# Altium schematic sheet Dogfish3D - Driver Channel.SchDoc
size A
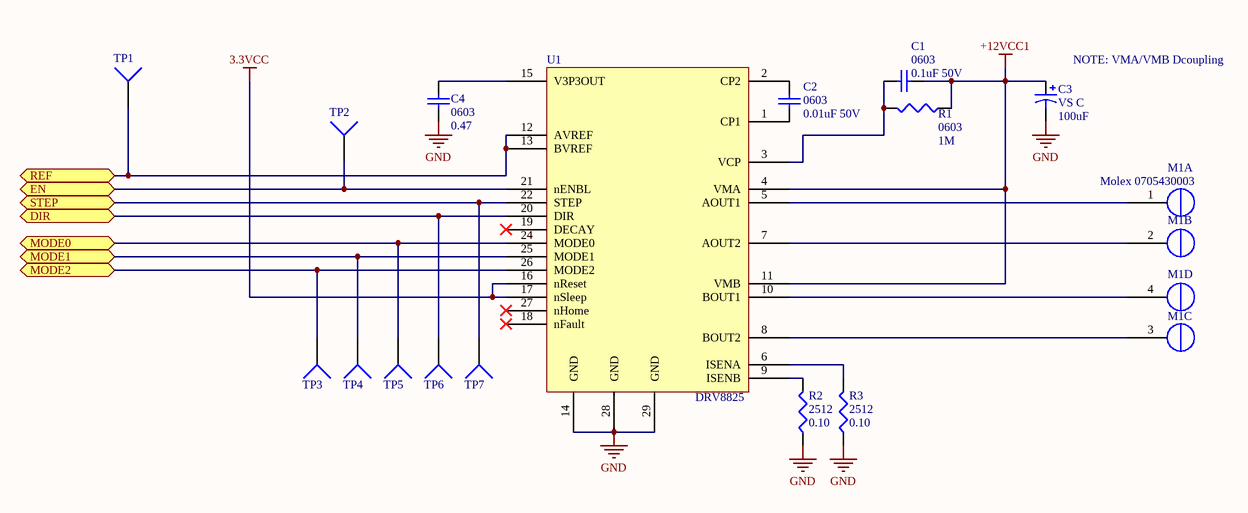
[diagram p0: Dogfish3D - Driver Channel.SchDoc]

## Parts
C1  0603  value 0.1uF 50V  [1608[0603]]
C2  0603  value 0.01uF 50V  [1608[0603]]
C3  VS C  value 100uF  [Panasonic VS C]
C4  0603  value 0.47  [1608[0603]]
M1  Molex 0705430003  [4POL254]  (parts A,B,C,D of 4)
R1  0603  value 1M  [J1-0603]
R2  2512  value 0.10  [Resistor2512]
R3  2512  value 0.10  [Resistor2512]
TP1  TP4  [TP-2]  (value not drawn)
TP2  TP4  [TP-2]  (value not drawn)
TP3  TP4  [TP-2]  (value not drawn)
TP4  TP4  [TP-2]  (value not drawn)
TP5  TP4  [TP-2]  (value not drawn)
TP6  TP4  [TP-2]  (value not drawn)
TP7  TP4  [TP-2]  (value not drawn)
U1  DRV8825  [DRV8825]

## Ports
DIR, EN, MODE0, MODE1, MODE2, REF, STEP

## Nets
3.3VCC: U1.16(nReset) U1.17(nSleep)
+12VCC1: C1.1 C3.1 R1.1 U1.4(VMA) U1.11(VMB)
GND: C3.2 C4.1 R2.1 R3.1 U1.14(GND) U1.28(GND) U1.29(GND)
DIR: TP6.1 U1.20(DIR) ; port DIR
EN: TP2.1 U1.21(nENBL) ; port EN
MODE0: TP5.1 U1.24(MODE0) ; port MODE0
MODE1: TP4.1 U1.25(MODE1) ; port MODE1
MODE2: TP3.1 U1.26(MODE2) ; port MODE2
REF: TP1.1 U1.12(AVREF) U1.13(BVREF) ; port REF
STEP: TP7.1 U1.22(STEP) ; port STEP
NetC1_2: C1.2 R1.2 U1.3(VCP)
NetC2_1: C2.1 U1.1(CP1)
NetC2_2: C2.2 U1.2(CP2)
NetC4_2: C4.2 U1.15(V3P3OUT)
NetM1_1: M1.1(OUT2B) U1.5(AOUT1)
NetM1_2: M1.2(OUT2A) U1.7(AOUT2)
NetM1_3: M1.3(OUT1A) U1.8(BOUT2)
NetM1_4: M1.4(OUT1B) U1.10(BOUT1)
NetR2_2: R2.2 U1.9(ISENB)
NetR3_2: R3.2 U1.6(ISENA)

Not connected (* = marked no-connect by the designer): U1 18(nFault)* 19(DECAY)* 23(NC) 27(nHome)*

## Notes on the sheet
- (near C3) NOTE: VMA/VMB Dcoupling

## Library data of the parts
C1 C2 C4 = Cap Semi: Capacitor (Semiconductor SIM Model); Published: 8-Jun-2000; LatestRevisionDate: 29-May-2009; LatestRevisionNote: IPC-7351 Footprint Added.; PackageReference: C1206; Publisher: Altium Limited; PackageDescription: Chip Capacitor
C3 = Cap Pol1: Polarized Capacitor (Radial); Published: 8-Jun-2000; LatestRevisionDate: 17-Jul-2002; LatestRevisionNote: Re-released for DXP Platform.; PackageReference: RB7.6-15; Publisher: Altium Limited; PackageDescription: Polarized Capacitor (Radial); 2 Leads
M1 = Molex 0705430003 Alt: Molex 4 Pin Clip Connector
R1-R3 = Res3: Resistor; Published: 8-Jun-2000; LatestRevisionDate: 29-May-2009; LatestRevisionNote: IPC-7351 Footprint Added.; PackageReference: J1-0603; Publisher: Altium Limited; PackageDescription: Chip Resistor
TP1-TP7 = Socket: LatestRevisionDate: 17-Jul-2002; LatestRevisionNote: Re-released for DXP Platform.; Publisher: Altium Limited
U1 = DRV8825: DRV8825 Ti Stepper Driver